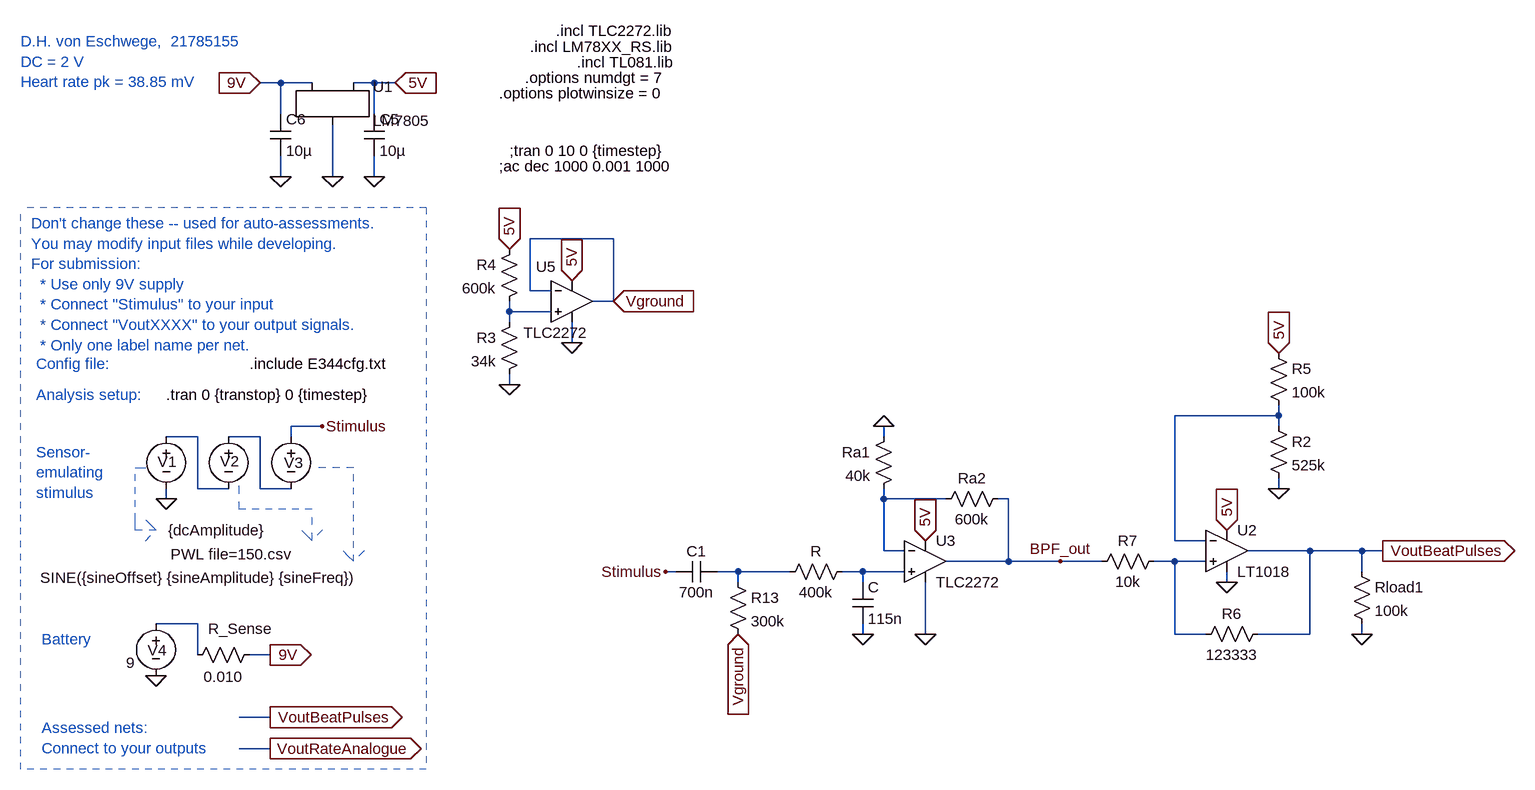
[diagram p0: schematic X_2ndOrderBPF_Schmitt - FilterGain.asc]
X_2ndOrderBPF_Schmitt - FilterGain.asc, the LTspice schematic file:
Version 4
SHEET 1 1824 680
WIRE -1904 -1600 -1936 -1600
WIRE -1856 -1600 -1904 -1600
WIRE -1760 -1600 -1792 -1600
WIRE -1728 -1600 -1760 -1600
WIRE -1904 -1552 -1904 -1600
WIRE -1760 -1552 -1760 -1600
WIRE -1904 -1456 -1904 -1488
WIRE -1824 -1456 -1824 -1536
WIRE -1760 -1456 -1760 -1488
WIRE -1392 -1360 -1520 -1360
WIRE -1520 -1280 -1520 -1360
WIRE -1488 -1280 -1520 -1280
WIRE -1392 -1264 -1392 -1360
WIRE -1392 -1264 -1424 -1264
WIRE -1552 -1248 -1552 -1264
WIRE -1488 -1248 -1552 -1248
WIRE -1552 -1232 -1552 -1248
WIRE -1456 -1200 -1456 -1232
WIRE -1552 -1136 -1552 -1152
WIRE -368 -1088 -368 -1104
WIRE -368 -1088 -528 -1088
WIRE -1840 -1072 -1888 -1072
WIRE -368 -1072 -368 -1088
WIRE -2032 -1056 -2080 -1056
WIRE -1936 -1056 -1984 -1056
WIRE -1888 -1056 -1888 -1072
WIRE -976 -1056 -976 -1072
WIRE -2032 -976 -2032 -1056
WIRE -1984 -976 -2032 -976
WIRE -1936 -976 -1936 -1056
WIRE -1888 -976 -1936 -976
WIRE -368 -976 -368 -992
WIRE -2080 -960 -2080 -976
WIRE -976 -960 -976 -976
WIRE -880 -960 -976 -960
WIRE -784 -960 -800 -960
WIRE -528 -896 -528 -1088
WIRE -480 -896 -528 -896
WIRE -976 -880 -976 -960
WIRE -944 -880 -976 -880
WIRE -320 -880 -416 -880
WIRE -240 -880 -320 -880
WIRE -208 -880 -240 -880
WIRE -784 -864 -784 -960
WIRE -784 -864 -880 -864
WIRE -704 -864 -784 -864
WIRE -640 -864 -704 -864
WIRE -528 -864 -560 -864
WIRE -480 -864 -528 -864
WIRE -1296 -848 -1312 -848
WIRE -1200 -848 -1232 -848
WIRE -1120 -848 -1200 -848
WIRE -1008 -848 -1040 -848
WIRE -944 -848 -1008 -848
WIRE -240 -848 -240 -880
WIRE -1200 -832 -1200 -848
WIRE -1008 -832 -1008 -848
WIRE -448 -832 -448 -848
WIRE -2032 -768 -2096 -768
WIRE -1008 -752 -1008 -768
WIRE -912 -752 -912 -832
WIRE -528 -752 -528 -864
WIRE -480 -752 -528 -752
WIRE -320 -752 -320 -880
WIRE -320 -752 -400 -752
WIRE -240 -752 -240 -768
WIRE -2032 -720 -2032 -768
WIRE -1920 -720 -1952 -720
WIRE -1920 -624 -1968 -624
WIRE -1920 -576 -1968 -576
FLAG -2080 -960 0
FLAG -1840 -1072 Stimulus
FLAG -1920 -720 9V
IOPIN -1920 -720 Out
FLAG -2096 -688 0
FLAG -1920 -624 VoutBeatPulses
IOPIN -1920 -624 Out
FLAG -1920 -576 VoutRateAnalogue
IOPIN -1920 -576 Out
FLAG -1824 -1456 0
FLAG -912 -752 0
FLAG -1008 -752 0
FLAG -976 -1072 0
FLAG -1936 -1600 9V
IOPIN -1936 -1600 In
FLAG -1904 -1456 0
FLAG -1760 -1456 0
FLAG -1728 -1600 5V
IOPIN -1728 -1600 In
FLAG -912 -896 5V
IOPIN -912 -896 In
FLAG -704 -864 BPF_out
FLAG -1552 -1136 0
FLAG -1552 -1344 5V
IOPIN -1552 -1344 In
FLAG -1456 -1200 0
FLAG -1456 -1296 5V
IOPIN -1456 -1296 In
FLAG -1312 -848 Stimulus
FLAG -1392 -1264 Vground
IOPIN -1392 -1264 In
FLAG -1200 -752 Vground
IOPIN -1200 -752 In
FLAG -240 -752 0
FLAG -208 -880 VoutBeatPulses
IOPIN -208 -880 Out
FLAG -448 -912 5V
IOPIN -448 -912 In
FLAG -448 -832 0
FLAG -368 -976 0
FLAG -368 -1184 5V
IOPIN -368 -1184 In
SYMBOL voltage -1984 -1072 R0
WINDOW 123 0 0 Left 0
WINDOW 39 0 0 Left 0
WINDOW 3 -89 197 Left 2
WINDOW 0 -13 54 Left 2
SYMATTR Value PWL file=150.csv
SYMATTR InstName V2
SYMBOL voltage -1888 -1072 R0
WINDOW 123 24 44 Left 2
WINDOW 39 0 0 Left 0
WINDOW 3 -386 233 Left 2
WINDOW 0 -11 56 Left 2
SYMATTR Value SINE({sineOffset} {sineAmplitude} {sineFreq})
SYMATTR InstName V3
SYMBOL voltage -2080 -1072 R0
WINDOW 123 0 0 Left 0
WINDOW 39 0 0 Left 0
WINDOW 3 3 160 Left 2
WINDOW 0 -13 55 Left 2
SYMATTR Value {dcAmplitude}
SYMATTR InstName V1
SYMBOL voltage -2096 -784 R0
WINDOW 123 24 44 Left 2
WINDOW 39 0 0 Left 0
WINDOW 3 -46 76 Left 2
WINDOW 0 -13 57 Left 2
SYMATTR Value 9
SYMATTR InstName V4
SYMBOL res -1936 -736 R90
WINDOW 0 -9 30 VBottom 2
WINDOW 3 34 56 VTop 2
SYMATTR InstName R_Sense
SYMATTR Value 0.010
SYMBOL LM7805 -1824 -1584 R0
SYMATTR InstName U1
SYMBOL cap -1024 -832 R0
SYMATTR InstName C
SYMATTR Value 115n
SYMBOL Opamps\\opamp2 -912 -928 R0
SYMATTR InstName U3
SYMATTR Value TLC2272
SYMBOL res -1024 -864 R90
WINDOW 0 0 56 VBottom 2
WINDOW 3 32 56 VTop 2
SYMATTR InstName R
SYMATTR Value 400k
SYMBOL res -784 -976 R90
WINDOW 0 0 56 VBottom 2
WINDOW 3 32 56 VTop 2
SYMATTR InstName Ra2
SYMATTR Value 600k
SYMBOL res -960 -1072 M0
SYMATTR InstName Ra1
SYMATTR Value 40k
SYMBOL cap -1776 -1552 R0
SYMATTR InstName C5
SYMATTR Value 10µ
SYMBOL cap -1920 -1552 R0
SYMATTR InstName C6
SYMATTR Value 10µ
SYMBOL cap -1232 -864 R90
WINDOW 0 0 32 VBottom 2
WINDOW 3 32 32 VTop 2
SYMATTR InstName C1
SYMATTR Value 700n
SYMBOL res -1536 -1248 M0
SYMATTR InstName R3
SYMATTR Value 34k
SYMBOL res -1536 -1360 M0
SYMATTR InstName R4
SYMATTR Value 600k
SYMBOL Opamps\\opamp2 -1456 -1328 R0
WINDOW 0 -55 11 Left 2
WINDOW 3 -74 112 Left 2
SYMATTR InstName U5
SYMATTR Value TLC2272
SYMBOL res -1216 -848 R0
SYMATTR InstName R13
SYMATTR Value 300k
SYMBOL res -256 -864 R0
SYMATTR InstName Rload1
SYMATTR Value 100k
SYMBOL Comparators\\LT1018 -448 -880 R0
SYMATTR InstName U2
SYMBOL res -384 -1088 R0
SYMATTR InstName R2
SYMATTR Value 525k
SYMBOL res -384 -1200 R0
SYMATTR InstName R5
SYMATTR Value 100k
SYMBOL res -384 -768 R90
WINDOW 0 0 56 VBottom 2
WINDOW 3 32 56 VTop 2
SYMATTR InstName R6
SYMATTR Value 123333
SYMBOL res -544 -880 R90
WINDOW 0 0 56 VBottom 2
WINDOW 3 32 56 VTop 2
SYMATTR InstName R7
SYMATTR Value 10k
TEXT -2080 -1120 Left 2 !.tran 0 {transtop} 0 {timestep}
TEXT -1952 -1168 Left 2 !.include E344cfg.txt
TEXT -2288 -1384 Left 2 ;Don't change these -- used for auto-assessments.\nYou may modify input files while developing.\nFor submission: \n  * Use only 9V supply \n  * Connect "Stimulus" to your input\n  * Connect "VoutXXXX" to your output signals.\n  * Only one label name per net.
TEXT -2280 -1168 Left 2 ;Config file:
TEXT -2280 -1120 Left 2 ;Analysis setup:
TEXT -2272 -744 Left 2 ;Battery
TEXT -2280 -1032 Left 2 ;Sensor-\nemulating \nstimulus
TEXT -2272 -608 Left 2 ;Assessed nets:\nConnect to your outputs
TEXT -2304 -1664 Left 2 ;D.H. von Eschwege,  21785155\nDC = 2 V\nHeart rate pk = 38.85 mV
TEXT -1480 -1680 Left 2 !.incl TLC2272.lib
TEXT -1520 -1656 Left 2 !.incl LM78XX_RS.lib
TEXT -1448 -1632 Left 2 !.incl TL081.lib
TEXT -1528 -1608 Left 2 !.options numdgt = 7
TEXT -1568 -1584 Left 2 !.options plotwinsize = 0
TEXT -1568 -1472 Left 2 !;ac dec 1000 0.001 1000
TEXT -1552 -1496 Left 2 !;tran 0 10 0 {timestep}
LINE Normal -1792 -1008 -1856 -1008 2
LINE Normal -1792 -864 -1792 -1008 2
LINE Normal -1808 -880 -1792 -864 2
LINE Normal -1792 -864 -1808 -880 2
LINE Normal -1776 -880 -1792 -864 2
LINE Normal -2128 -1008 -2112 -1008 2
LINE Normal -2128 -928 -2128 -1008 2
LINE Normal -2128 -912 -2128 -928 2
LINE Normal -2096 -912 -2128 -912 2
LINE Normal -2112 -928 -2096 -912 2
LINE Normal -2096 -912 -2112 -928 2
LINE Normal -2112 -896 -2096 -912 2
LINE Normal -1968 -944 -1968 -992 2
LINE Normal -1856 -944 -1968 -944 2
LINE Normal -1856 -896 -1856 -944 2
LINE Normal -1872 -912 -1856 -896 2
LINE Normal -1856 -896 -1872 -912 2
LINE Normal -1840 -912 -1856 -896 2
LINE Normal -2304 -544 -2304 -1408 1
LINE Normal -1680 -1408 -1680 -544 1
LINE Normal -1680 -544 -2304 -544 1
LINE Normal -1680 -1408 -2304 -1408 1

The netlist it stands for:
* X_2ndOrderBPF_Schmitt - FilterGain.asc
V2 N004 N003 PWL file=150.csv
V3 Stimulus N004 SINE({sineOffset} {sineAmplitude} {sineFreq})
V1 N003 0 {dcAmplitude}
V4 N009 0 9
R_Sense 9V N009 0.010
XU1 9V 0 5V LM7805
C N008 0 115n
XU3 N008 N005 5V 0 BPF_out TLC2272  ; pins In+ In- V+ V- OUT
R N008 N007 400k
Ra2 BPF_out N005 600k
Ra1 0 N005 40k
C5 5V 0 10µ
C6 9V 0 10µ
C1 N007 Stimulus 700n
R3 N001 0 34k
R4 5V N001 600k
XU5 N001 Vground 5V 0 Vground TLC2272  ; pins In+ In- V+ V- OUT
R13 N007 Vground 300k
Rload1 VoutBeatPulses 0 100k
XU2 N006 N002 5V 0 VoutBeatPulses LT1018  ; pins In+ In- V+ V- OUT
R2 N002 0 525k
R5 5V N002 100k
R6 VoutBeatPulses N006 123333
R7 N006 BPF_out 10k
.tran 0 {transtop} 0 {timestep}
.include E344cfg.txt
* Don't change these -- used for auto-assessments.
* You may modify input files while developing.
* For submission:
*   * Use only 9V supply
*   * Connect "Stimulus" to your input
*   * Connect "VoutXXXX" to your output signals.
*   * Only one label name per net.
* Config file:
* Analysis setup:
* Battery
* Sensor-
* emulating
* stimulus
* Assessed nets:
* Connect to your outputs
* D.H. von Eschwege,  21785155
* DC = 2 V
* Heart rate pk = 38.85 mV
.incl TLC2272.lib
.incl LM78XX_RS.lib
.incl TL081.lib
.options numdgt = 7
.options plotwinsize = 0
;ac dec 1000 0.001 1000
;tran 0 10 0 {timestep}
.lib LTC1.lib
.backanno
.end